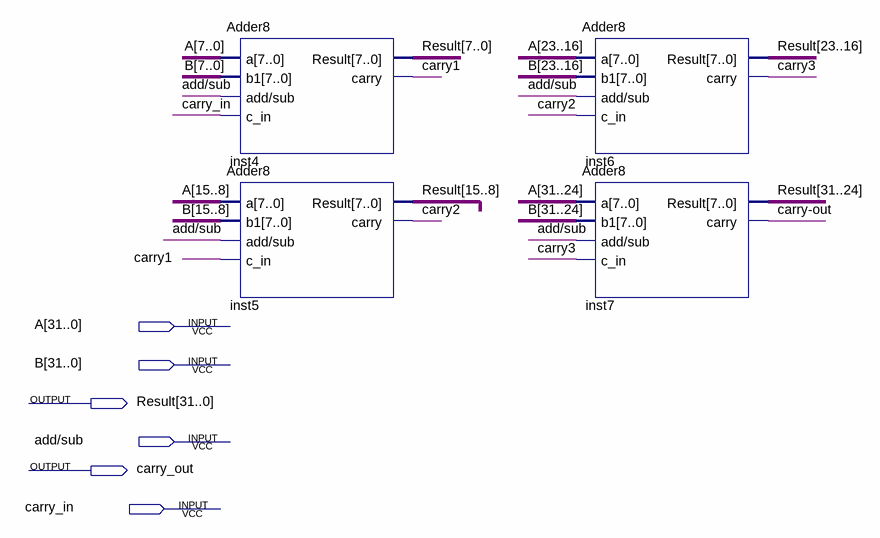
[diagram p0: schematic sheet]
// Quartus schematic AddorSub.bdf as structural Verilog: 4 symbols, 6 pins
module AddorSub (
  input  [31:0] A,
  input  [31:0] B,
  input  \add/sub ,
  input  carry_in,
  output [31:0] Result,
  output carry_out
);

  wire carry1, carry2, carry3, \carry-out ;

  Adder8 inst4 (.a(A[7:0]), .b1(B[7:0]), .\add/sub (\add/sub ), .c_in(carry_in), .Result(Result[7:0]), .carry(carry1));
  Adder8 inst5 (.a(A[15:8]), .b1(B[15:8]), .\add/sub (\add/sub ), .c_in(carry1), .Result(Result[15:8]), .carry(carry2));
  Adder8 inst6 (
    .a(A[23:16]), .b1(B[23:16]), .\add/sub (\add/sub ), .c_in(carry2), .Result(Result[23:16]), .carry(carry3));
  Adder8 inst7 (
    .a(A[31:24]), .b1(B[31:24]), .\add/sub (\add/sub ), .c_in(carry3), .Result(Result[31:24]),
    .carry(\carry-out ));
endmodule
